# Altium schematic sheet MCU.SchDoc
size A4; SheetNumber: 2; SheetTotal: 9
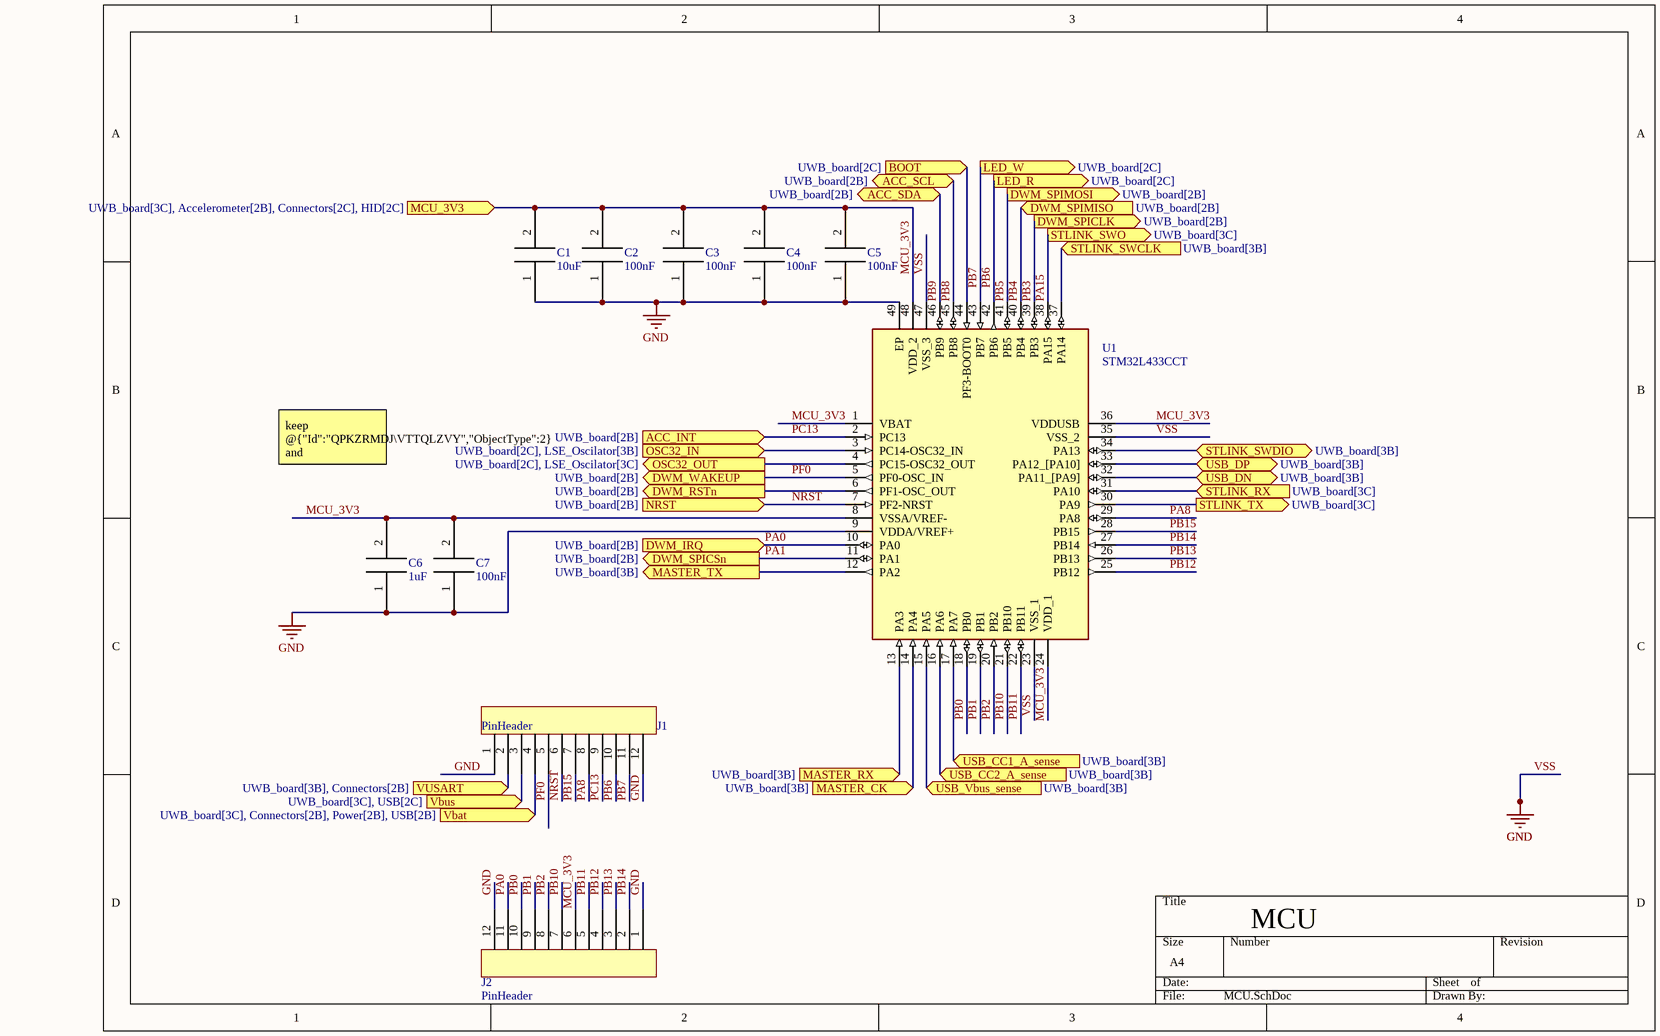
[diagram p0: MCU.SchDoc]

## Parts
C1  10uF  [0603_cap]
C2  100nF  [0603_cap]
C3  100nF  [0603_cap]
C4  100nF  [0603_cap]
C5  100nF  [0603_cap]
C6  1uF  [0603_cap]
C7  100nF  [0603_cap]
J1  PinHeader  [PINs]
J2  PinHeader  [PINs]
U1  STM32L433CCT  [LQFP50]

## Ports
ACC_INT (in, see UWB_board[2B]), ACC_SCL (bidir, see UWB_board[2B]), ACC_SDA (bidir, see UWB_board[2B]), BOOT (in, see UWB_board[2C]), DWM_IRQ (in, see UWB_board[2B]), DWM_RSTn (out, see UWB_board[2B]), DWM_SPICLK (out, see UWB_board[2B]), DWM_SPICSn (out, see UWB_board[2B]), DWM_SPIMISO (in, see UWB_board[2B]), DWM_SPIMOSI (out, see UWB_board[2B]), DWM_WAKEUP (out, see UWB_board[2B]), LED_R (out, see UWB_board[2C]), LED_W (out, see UWB_board[2C]), MASTER_CK (in, see UWB_board[3B]), MASTER_RX (in, see UWB_board[3B]), MASTER_TX (out, see UWB_board[3B]), MCU_3V3 (in, see UWB_board[3C], Accelerometer[2B], Connectors[2C], HID[2C]), NRST (in, see UWB_board[2B]), OSC32_IN (in, see UWB_board[2C], LSE_Oscilator[3B]), OSC32_OUT (out, see UWB_board[2C], LSE_Oscilator[3C]), STLINK_RX (in, see UWB_board[3C]), STLINK_SWCLK (in, see UWB_board[3B]), STLINK_SWDIO (bidir, see UWB_board[3B]), STLINK_SWO (out, see UWB_board[3C]), STLINK_TX (out, see UWB_board[3C]), USB_CC1_A_sense (in, see UWB_board[3B]), USB_CC2_A_sense (in, see UWB_board[3B]), USB_DN (bidir, see UWB_board[3B]), USB_DP (bidir, see UWB_board[3B]), USB_Vbus_sense (in, see UWB_board[3B]), Vbat (in, see UWB_board[3C], Connectors[2B], Power[2B], USB[2B]), Vbus (in, see UWB_board[3C], USB[2C]), VUSART (in, see UWB_board[3B], Connectors[2B])

## Nets
GND: C1.1 C2.1 C3.1 C4.1 C5.1 C6.1 C7.1 J1.1 J1.12 J2.1 J2.12 U1.9(VDDA/VREF+) U1.23(VSS_1) U1.35(VSS_2) U1.47(VSS_3) U1.49(EP)  [also labelled VSS]
BOOT: U1.44(PF3-BOOT0) ; port BOOT
DWM_RSTn: U1.6(PF1-OSC_OUT) ; port DWM_RSTn
MASTER_CK: U1.14(PA4) ; port MASTER_CK
MASTER_RX: U1.13(PA3) ; port MASTER_RX
MASTER_TX: U1.12(PA2) ; port MASTER_TX
MCU_3V3: C1.2 C2.2 C3.2 C4.2 C5.2 C6.2 C7.2 J2.6 U1.1(VBAT) U1.8(VSSA/VREF-) U1.24(VDD_1) U1.36(VDDUSB) U1.48(VDD_2) ; port MCU_3V3
NRST: J1.6 U1.7(PF2-NRST) ; port NRST
OSC32_IN: U1.3(PC14-OSC32_IN) ; port OSC32_IN
OSC32_OUT: U1.4(PC15-OSC32_OUT) ; port OSC32_OUT
PA0: J2.11 U1.10(PA0) ; port DWM_IRQ
PA1: U1.11(PA1) ; port DWM_SPICSn
PA8: J1.8 U1.29(PA8)
PA15: U1.38(PA15) ; port STLINK_SWO
PB0: J2.10 U1.18(PB0)
PB1: J2.9 U1.19(PB1)
PB2: J2.8 U1.20(PB2)
PB3: U1.39(PB3) ; port DWM_SPICLK
PB4: U1.40(PB4) ; port DWM_SPIMISO
PB5: U1.41(PB5) ; port DWM_SPIMOSI
PB6: J1.10 U1.42(PB6) ; port LED_R
PB7: J1.11 U1.43(PB7) ; port LED_W
PB8: U1.45(PB8) ; port ACC_SCL
PB9: U1.46(PB9) ; port ACC_SDA
PB10: J2.7 U1.21(PB10)
PB11: J2.5 U1.22(PB11)
PB12: J2.4 U1.25(PB12)
PB13: J2.3 U1.26(PB13)
PB14: J2.2 U1.27(PB14)
PB15: J1.7 U1.28(PB15)
PC13: J1.9 U1.2(PC13) ; port ACC_INT
PF0: J1.5 U1.5(PF0-OSC_IN) ; port DWM_WAKEUP
STLINK_RX: U1.31(PA10) ; port STLINK_RX
STLINK_SWCLK: U1.37(PA14) ; port STLINK_SWCLK
STLINK_SWDIO: U1.34(PA13) ; port STLINK_SWDIO
STLINK_TX: U1.30(PA9) ; port STLINK_TX
USB_CC1_A_sense: U1.17(PA7) ; port USB_CC1_A_sense
USB_CC2_A_sense: U1.16(PA6) ; port USB_CC2_A_sense
USB_DN: U1.32(PA11_[PA9]) ; port USB_DN
USB_DP: U1.33(PA12_[PA10]) ; port USB_DP
USB_Vbus_sense: U1.15(PA5) ; port USB_Vbus_sense
Vbat: J1.4 ; port Vbat
Vbus: J1.3 ; port Vbus
VUSART: J1.2 ; port VUSART

## Notes on the sheet
- keep @{"Id":"QPKZRMDJ\VTTQLZVY","ObjectType":2} and @{"Id":"QPKZRMDJ\RWWDCKLV","ObjectType":2} close to VSSA and VDDA pins
- MCU

## Library data of the parts
C1 = CL10A106KP8NNNC: 100nF 50V X7R ±10% 0603 Multilayer Ceramic Capacitors MLCC - SMD/SMT ROHS; LCSC Part #: C19702; Value: 10uF
C2-C5 C7 = CC0603KRX7R9BB104: 100nF 50V X7R ±10% 0603 Multilayer Ceramic Capacitors MLCC - SMD/SMT ROHS; LCSC Part #: C14663; Value: 100nF
C6 = CL10A105KB8NNNC: 1uF 50V X5R ±10% 0603 Multilayer Ceramic Capacitors MLCC - SMD/SMT ROHS; LCSC Part #: C15849; Value: 1uF
U1 = STM32L433CCT: Manufacturer_Name: STMicroelectronics; Manufacturer_Part_Number: STM32L433CCT